# EAGLE design planty1 (EAGLE 9.6.2)
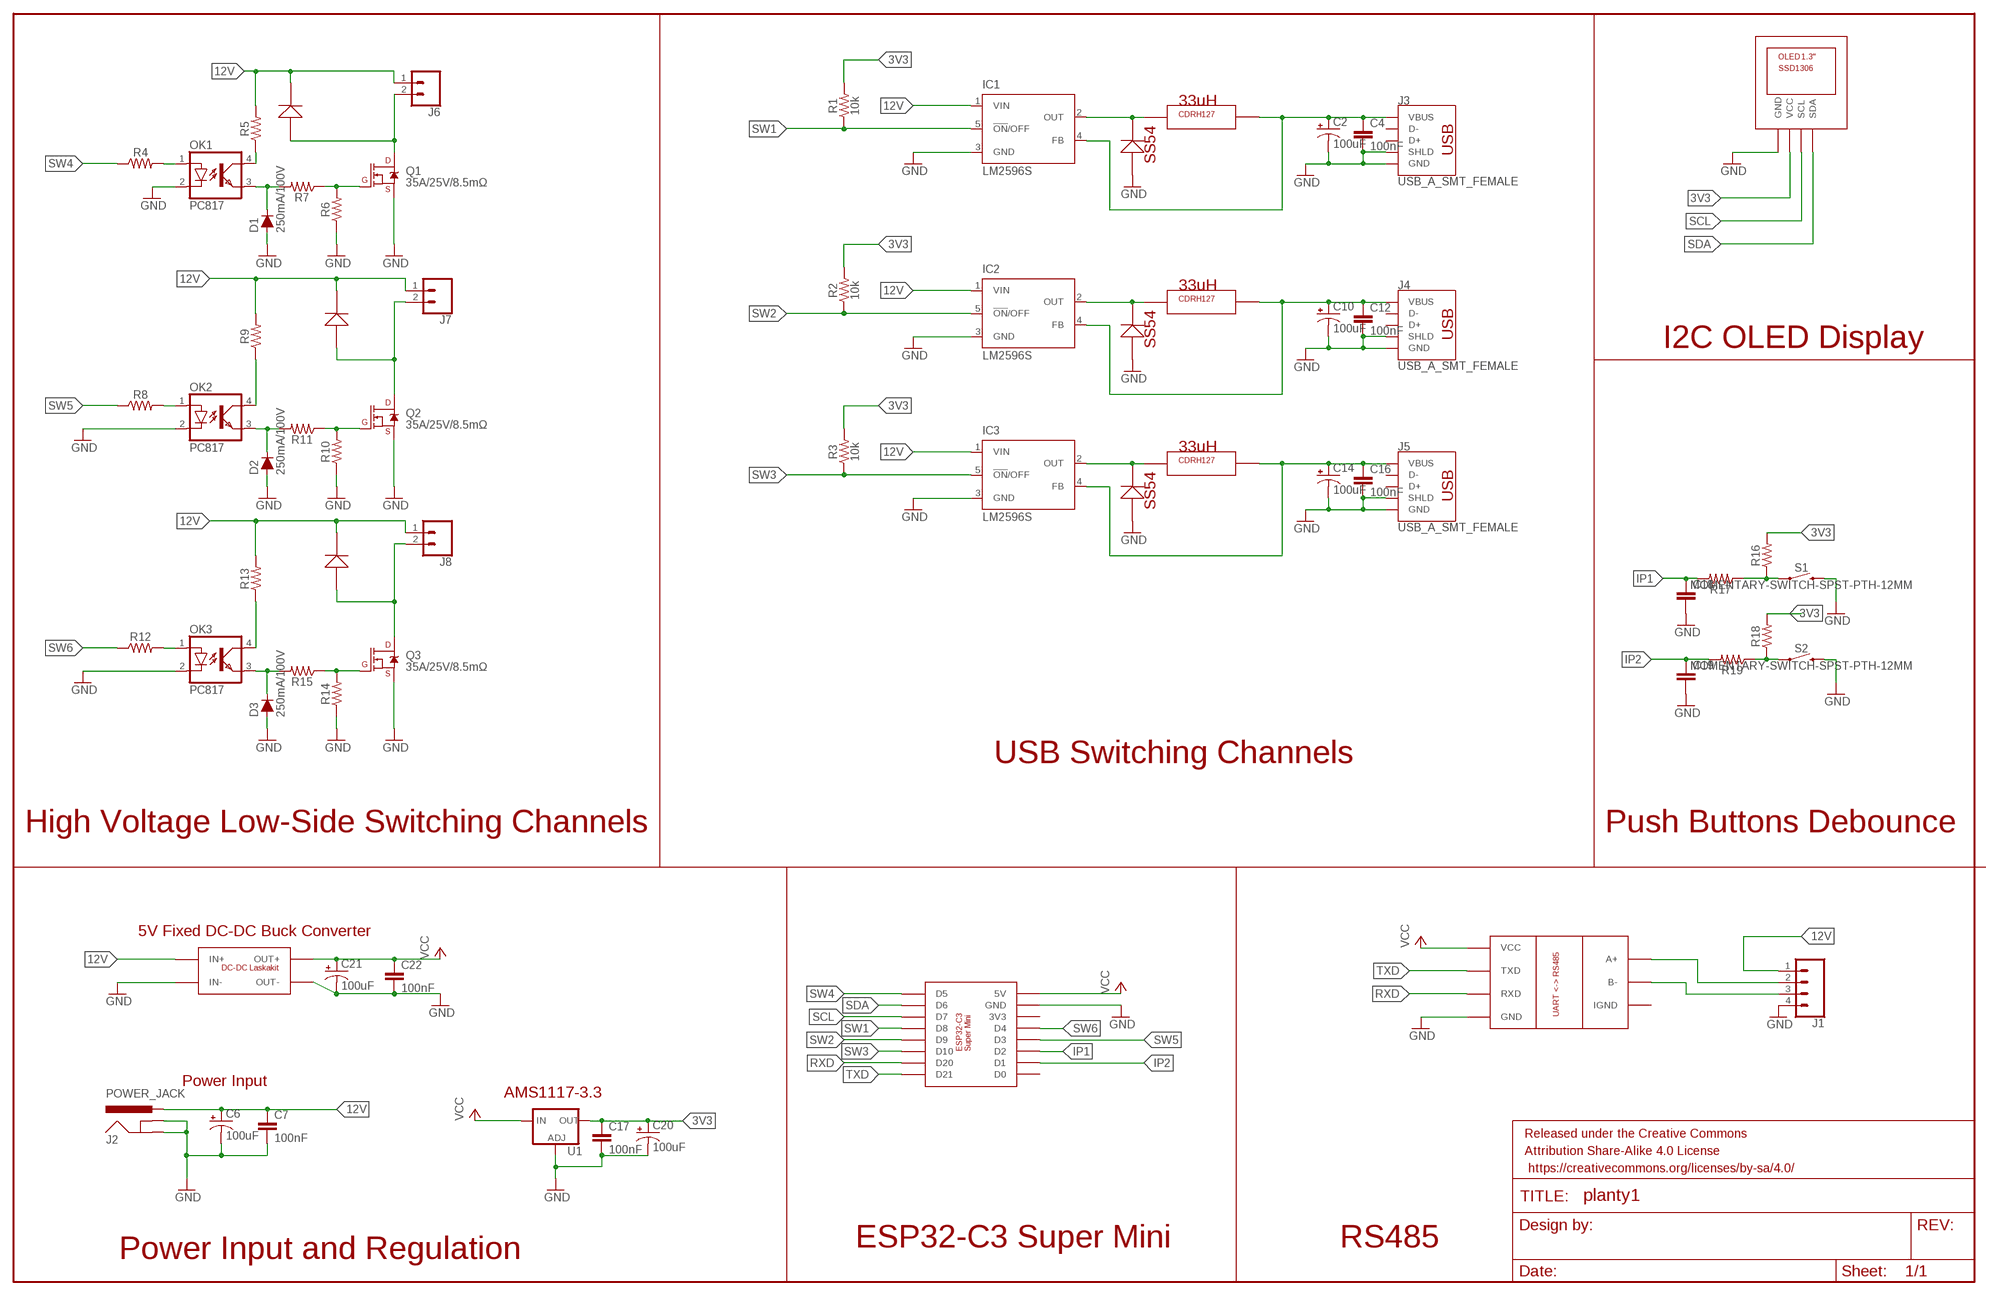
[diagram p0: schematic, sheet 1]

## Parts
C2  100uF  100UF-POLAR-RADIAL-2.5MM-25V-20%  [CPOL-RADIAL-2.5MM-6.5MM]
C4  100nF  CAP-1206  [1206]
C6  100uF  100UF-POLAR-RADIAL-2.5MM-25V-20%  [CPOL-RADIAL-2.5MM-6.5MM]
C7  100nF  CAP-1206  [1206]
C10  100uF  100UF-POLAR-RADIAL-2.5MM-25V-20%  [CPOL-RADIAL-2.5MM-6.5MM]
C12  100nF  CAP-1206  [1206]
C14  100uF  100UF-POLAR-RADIAL-2.5MM-25V-20%  [CPOL-RADIAL-2.5MM-6.5MM]
C16  100nF  CAP-1206  [1206]
C17  100nF  CAP-0603  [0603]
C18  CAP-0603  [0603]
C19  CAP-0603  [0603]
C20  100uF  100UF-POLAR-RADIAL-2.5MM-25V-20%  [CPOL-RADIAL-2.5MM-6.5MM]
C21  100uF  100UF-POLAR-RADIAL-2.5MM-25V-20%  [CPOL-RADIAL-2.5MM-6.5MM]
C22  100nF  CAP-1206  [1206]
D1  250mA/100V  DIODE-BAS16J  [SOD-323]
D2  250mA/100V  DIODE-BAS16J  [SOD-323]
D3  250mA/100V  DIODE-BAS16J  [SOD-323]
FRAME1  FRAME-LEDGERNO_FOOTPRINT  [DUMMY]
IC1  LM2596S  [TO263-5]
IC2  LM2596S  [TO263-5]
IC3  LM2596S  [TO263-5]
J1  CONN_04SCREW_LOCK  [SCREWTERMINAL-3.5MM-4_LOCK]
J2  POWER_JACK  [POWER_JACK_PTH]
J3  USB_A_SMT_FEMALE  [USB-A-S-SILK-FEMALE]
J4  USB_A_SMT_FEMALE  [USB-A-S-SILK-FEMALE]
J5  USB_A_SMT_FEMALE  [USB-A-S-SILK-FEMALE]
J6  CONN_025MM  [SCREWTERMINAL-5MM-2]
J7  CONN_025MM  [SCREWTERMINAL-5MM-2]
J8  CONN_025MM  [SCREWTERMINAL-5MM-2]
OK1  PC817  [DIL04]
OK2  PC817  [DIL04]
OK3  PC817  [DIL04]
Q1  35A/25V/8.5mΩ  MOSFET-NCH-FDD8780  [TO-252/DPAK]
Q2  35A/25V/8.5mΩ  MOSFET-NCH-FDD8780  [TO-252/DPAK]
Q3  35A/25V/8.5mΩ  MOSFET-NCH-FDD8780  [TO-252/DPAK]
R1  10k  RESISTOR0603  [0603]
R2  10k  RESISTOR0603  [0603]
R3  10k  RESISTOR0603  [0603]
R4  RESISTOR0603  [0603]
R5  RESISTOR0603  [0603]
R6  RESISTOR0603  [0603]
R7  RESISTOR0603  [0603]
R8  RESISTOR0603  [0603]
R9  RESISTOR0603  [0603]
R10  RESISTOR0603  [0603]
R11  RESISTOR0603  [0603]
R12  RESISTOR0603  [0603]
R13  RESISTOR0603  [0603]
R14  RESISTOR0603  [0603]
R15  RESISTOR0603  [0603]
R16  RESISTOR0603  [0603]
R17  RESISTOR0603  [0603]
R18  RESISTOR0603  [0603]
R19  RESISTOR0603  [0603]
S1  MOMENTARY-SWITCH-SPST-PTH-12MM  [TACTILE_SWITCH_PTH_12MM]
S2  MOMENTARY-SWITCH-SPST-PTH-12MM  [TACTILE_SWITCH_PTH_12MM]
U1  V_REG_LM1117SOT223  [SOT223]
U$1  ESP32-C3-SUPER-MINI  [ESP32-C3-SUPER-MINI]
U$2  RS485-UART-CONVERTER  [RS485_MODULE]
U$3  CDRH127  [CDRH127]
U$4  SS54  [SS54]
U$5  DC-DC-LASKAKIT  [DC-DC-MODULE-LASKAKIT]
U$6  CDRH127  [CDRH127]
U$7  SS54  [SS54]
U$8  CDRH127 - 33uH  CDRH127  [CDRH127]
U$9  SS54  [SS54]
U$10  SS54  [SS54]
U$11  SS54  [SS54]
U$12  SS54  [SS54]
U$13  OLED_0.96_I2C  [OLED_0.96]

## Nets
3V3: C17.1 C20.1(+) R1.2 R2.2 R3.2 R16.2 R18.2 U1.2(OUT) U1.4(OUT) U$13.P$2(VCC)
12V: C6.1(+) C7.1 IC1.1(VIN) IC2.1(VIN) IC3.1(VIN) J1.1 J2.PWR J6.1 J7.1 J8.1 R5.2 R9.2 R13.2 U$5.IN+ U$10.N U$11.N U$12.N
GND: C2.2(-) C4.2 C6.2(-) C7.2 C10.2(-) C12.2 C14.2(-) C16.2 C17.2 C18.2 C19.2 C20.2(-) C21.2(-) C22.2 D1.A D2.A D3.A IC1.3(GND) IC2.3(GND) IC3.3(GND) J1.4 J2.GND J2.GNDBREAK J3.GND J3.SHLD1(SHLD) J3.SHLD2(SHLD) J4.GND J4.SHLD1(SHLD) J4.SHLD2(SHLD) J5.GND J5.SHLD1(SHLD) J5.SHLD2(SHLD) OK1.2(C) OK2.2(C) OK3.2(C) Q1.3(S) Q2.3(S) Q3.3(S) R6.1 R10.1 R14.1 S1.3 S2.3 U1.1(ADJ) U$1.P$15(GND) U$2.GND U$4.P U$5.IN- U$5.OUT- U$7.P U$9.P U$13.P$1(GND)
IP1: C18.1 R17.2 U$1.P$11(D2)
IP2: C19.1 R19.2 U$1.P$10(D1)
N$1: J1.2 U$2.A+
N$2: J1.3 U$2.B-
N$3: IC1.2(OUT) U$3.P$1 U$4.N
N$4: C2.1(+) C4.1 IC1.4(FB) J3.VBUS U$3.P$2
N$5: IC2.2(OUT) U$6.P$1 U$7.N
N$6: C10.1(+) C12.1 IC2.4(FB) J4.VBUS U$6.P$2
N$7: IC3.2(OUT) U$8.P$1 U$9.N
N$8: C14.1(+) C16.1 IC3.4(FB) J5.VBUS U$8.P$2
N$9: OK1.1(A) R4.2
N$10: OK1.4(COL) R5.1
N$11: Q1.1(G) R6.2 R7.1
N$12: D1.C OK1.3(EMIT) R7.2
N$13: J6.2 Q1.2(D) U$10.P
N$14: OK2.1(A) R8.2
N$15: OK2.4(COL) R9.1
N$16: Q2.1(G) R10.2 R11.1
N$17: D2.C OK2.3(EMIT) R11.2
N$18: J7.2 Q2.2(D) U$11.P
N$19: OK3.1(A) R12.2
N$20: OK3.4(COL) R13.1
N$21: Q3.1(G) R14.2 R15.1
N$22: D3.C OK3.3(EMIT) R15.2
N$23: J8.2 Q3.2(D) U$12.P
N$24: R18.1 R19.1 S2.1
N$25: R16.1 R17.1 S1.1
RXD: U$1.P$7(D20) U$2.RXD
SCL: U$1.P$3(D7) U$13.P$3(SCL)
SDA: U$1.P$2(D6) U$13.P$4(SDA)
SW1: IC1.5(!ON!/OFF) R1.1 U$1.P$4(D8)
SW2: IC2.5(!ON!/OFF) R2.1 U$1.P$5(D9)
SW3: IC3.5(!ON!/OFF) R3.1 U$1.P$6(D10)
SW4: R4.1 U$1.P$1(D5)
SW5: R8.1 U$1.P$12(D3)
SW6: R12.1 U$1.P$13(D4)
TXD: U$1.P$8(D21) U$2.TXD
VCC: C21.1(+) C22.1 U1.3(IN) U$1.P$16(5V) U$2.VCC U$5.OUT+
Unconnected: J3.D+ J3.D- J4.D+ J4.D- J5.D+ J5.D- U$1.P$9(D0) U$1.P$14(3V3) U$2.ISOGND(IGND)

## Notes on the sheet
- 33uH
- SS54
- 33uH
- SS54 | I2C OLED Display
- 33uH
- SS54
- USB Switching Channels
- High Voltage Low-Side Switching Channels | Push Buttons Debounce
- 5V Fixed DC-DC Buck Converter
- Power Input
- AMS1117-3.3
- Power Input and Regulation
- ESP32-C3 Super Mini | RS485

## Library data of the parts
C2 C6 C10 C14 C20 C21 = SparkFun-Capacitors:100UF-POLAR: 100µF polarized capacitors A capacitor is a passive two-terminal electrical component used to store electrical energy temporarily in an electric field.; PROD_ID: CAP-08439
C4 C7 C12 C16-C19 C22 = SparkFun-Capacitors:CAP
D1-D3 = SparkFun-DiscreteSemi:DIODE: Diode These are standard reverse protection diodes and small signal diodes. SparkFun Products: SparkFun SparkPunk Sound Kit <https://www.sparkfun.com/products/11177> SparkFun ESP8266 Thing <https://www.sparkfun.com/products/13231>; PROD_ID: DIO-09646
FRAME1 = SparkFun-Aesthetics:FRAME-LEDGER: Schematic Frame - Ledger Standard 11x14 US Ledger frame
IC1-IC3 = national-semiconductor:LM2596: SIMPLE SWITCHER® Power Converter 150 kHz 3A Step-Down Voltage Regulator Source: http://www.national.com/ds/LM/LM2596.pdf; MF: NATIONAL SEMICONDUCTOR; MPN: LM2596S-ADJ/NOPB; OC_FARNELL: 9494367; OC_NEWARK: 41K3842
J1 = SparkFun-Connectors:CONN_04: Multi connection point. Often used as Generic Header-pin footprint for 0.1 inch spaced/style header connections On any of the 0.1 inch spaced packages, you can populate with these: Break Away Headers - Straight <https://www.sparkfun.com/products/116> (PRT-00116) Break Away Male Headers - Right Angle <https://www.sparkfun.com/products/553> (PRT-00553) Female Headers <https://www.sparkfun.com/products/115> (PRT-00115) Break Away Headers - Machine Pin <https://www.sparkfun.com/products/117> (PRT-00117) Break Away Female Headers - Swiss Machine Pin <https://www.sparkfun.com/products/743> (PRT-00743) For SCREWTERMINALS and SPRING TERMINALS visit here: Screw Terimnals on SparkFun.com <https://www.sparkfun.com/search/results?term=Screw+Terminals> (5mm/3.5mm/2.54mm spacing) This device is also useful as a general connection point to wire up your design to another part of your project. Our various solder wires solder well into these plated through hole pads. Hook-Up Wire - Assortment (Stranded, 22 AWG) <https://www.sparkfun.com/products/11375> (PRT-11375) Hook-Up Wire - Assortment (Solid Core, 22 AWG) <https://www.sparkfun.com/products/11367> (PRT-11367) View the entire wire category on our website here <https://www.sparkfun.com/categories/141> Special notes: Molex polarized connector foot print use with SKU : PRT-08231 with associated crimp pins and housings. 1MM SMD Version SKU: PRT-10208
J2 = SparkFun-Connectors:POWER_JACK: Power Jack Connector This is the standard 5.5mm barrel jack for power. The PTH is the most common, proven, reliable, footprint. The Slot footprint only works if the mill layer is transmitted to the PCB fab house so be warned. Here are the connectors we sell at SparkFun: DC Barrel Power Jack/Connector <https://www.sparkfun.com/products/119> (PRT-00119) DC Barrel Power Jack/Connector (SMD) <https://www.sparkfun.com/products/12748> (PRT-12748) DC Barrel Jack Adapter - Breadboard Compatible <https://www.sparkfun.com/products/10811> (PRT-10811) It is used on this SparkFun product (and many, many others): SparkFun RedBoard - Programmed with Arduino <https://www.sparkfun.com/products/12757> (DEV-12757) Also, if you need a mating power supply or connector, please check these out: Wall Adapter Power Supply - 9VDC 650mA <https://www.sparkfun.com/products/298> (TOL-00298) DC Barrel Jack Adapter - Male <https://www.sparkfun.com/products/10287> (PRT-10287); PROD_ID: CONN-08197
J3-J5 = SparkFun-Connectors:USB_A: USB-A Connector Male and female variants, as well as PTH and SMT variants SparkFun Products: SparkFun XBee Explorer Dongle <https://www.sparkfun.com/products/11697> PTH Male SparkFun MicroView-USB Programmer <https://www.sparkfun.com/products/12924> SMT Male SparkFun USB Type A Female Breakout <https://www.sparkfun.com/products/12700> SMT Female; PROD_ID: CONN-09520; SF_ID: PRT-09011
J6-J8 = SparkFun-Connectors:CONN_02: Multi connection point. Often used as Generic Header-pin footprint for 0.1 inch spaced/style header connections On any of the 0.1 inch spaced packages, you can populate with these: Break Away Headers - Straight <https://www.sparkfun.com/products/116> (PRT-00116) Break Away Male Headers - Right Angle <https://www.sparkfun.com/products/553> (PRT-00553) Female Headers <https://www.sparkfun.com/products/115> (PRT-00115) Break Away Headers - Machine Pin <https://www.sparkfun.com/products/117> (PRT-00117) Break Away Female Headers - Swiss Machine Pin <https://www.sparkfun.com/products/743> (PRT-00743) For SCREWTERMINALS and SPRING TERMINALS visit here: Screw Terimnals on SparkFun.com <https://www.sparkfun.com/search/results?term=Screw+Terminals> (5mm/3.5mm/2.54mm spacing) This device is also useful as a general connection point to wire up your design to another part of your project. Our various solder wires solder well into these plated through hole pads. Hook-Up Wire - Assortment (Stranded, 22 AWG) <https://www.sparkfun.com/products/11375> (PRT-11375) Hook-Up Wire - Assortment (Solid Core, 22 AWG) <https://www.sparkfun.com/products/11367> (PRT-11367) View the entire wire category on our website here <https://www.sparkfun.com/categories/141> Special notes: Molex polarized connector foot print use with: PRT-08233 with associated crimp pins and housings. 2.54_SCREWTERM for use with PRT-10571. 3.5mm Screw Terminal footprints for PRT-08084 5mm Screw Terminal footprints for use with PRT-08432; SF_SKU: PRT-08432
OK1-OK3 = optocoupler:PC817: SHARP OPTO COUPLER; MPN: PC817X4J000F; OC_FARNELL: 9707727; OC_NEWARK: 97K7059
Q1-Q3 = SparkFun-DiscreteSemi:MOSFET-NCH: N-channel MOSFETs Voltage controlled devices that allow control of high current outputs. SparkFun Products: SparkFun OpenScale <https://www.sparkfun.com/products/13261> SparkFun Digital Sandbox <https://www.sparkfun.com/products/12651> SparkFun Monster Moto Shield <https://www.sparkfun.com/products/10182> SparkFun MOSFET Power Controller <https://www.sparkfun.com/products/11214>; PROD_ID: TRANS-09984
R1-R19 = SparkFun-Resistors:RESISTOR: Generic Resistor Package
S1 S2 = SparkFun-Switches:MOMENTARY-SWITCH-SPST: Momentary Switch (Pushbutton) - SPST Normally-open (NO) SPST momentary switches (buttons, pushbuttons). Variants PTH-12MM - 12mm square, through-hole Momentary Pushbutton Switch - 12mm Square <https://www.sparkfun.com/products/9190> (COM-09190) PTH-6.0MM, PTH-6.0MM-KIT - 6.0mm square, through-hole Mini Pushbutton Switch <https://www.sparkfun.com/products/97> (COM-00097) KIT package intended for soldering kit's - only one side of pads' copper is exposed. PTH-RIGHT-ANGLE-KIT - Right-angle, through-hole Right Angle Tactile Button <https://www.sparkfun.com/products/10791> - Used on SparkFun BigTime Watch Kit <https://www.sparkfun.com/products/11734> SMD-12MM - 12mm square, surface-mount Tactile Button - SMD (12mm) <https://www.sparkfun.com/products/12993> (COM-12993) Used on SparkFun PicoBoard <https://www.sparkfun.com/products/11888> SMD-4.5MM - 4.5mm Square Trackball Switch Used on SparkFun Blackberry Trackballer Breakout <https://www.sparkfun.com/products/13169> SMD-4.6MMX2.8MM - 4.60mm x 2.80mm, surface mount Used on SparkFun Pro Micro - RP2040 <https://www.sparkfun.com/products/17717> SMD-5.2MM, SMD-5.2-REDUNDANT - 5.2mm square, surface-mount Mini Pushbutton Switch - SMD <https://www.sparkfun.com/products/8720> (COM-08720) Used on Arduino Pro Mini <https://www.sparkfun.com/products/11114> REDUNDANT package connects both switch circuits together SMD-6.0X3.5MM - 6.0 x 3.5mm, surface mount Momentary Reset Switch SMD <https://www.sparkfun.com/products/8229> (COM-08229) SMD-6.2MM-TALL - 6.2mm square, surface mount Tactile Button - SMD (6mm) <https://www.sparkfun.com/products/12992> Used on SparkFun Digital Sandbox <https://www.sparkfun.com/products/12651> SMD-RIGHT-ANGLE - Right-angle, surface mount Used on SparkFun Block for Intel® Edison - Arduino <https://www.sparkfun.com/products/13036>; PROD_ID: SWCH-09185; SF_SKU: COM-09190
U1 = SparkFun-IC-Power:V_REG_LM1117: Voltage Regulator LM1117 Standard adjustable voltage regulator but in SMD form. Spark Fun Electronics SKU : COM-00595; PROD_ID: VREG-08170
U$1 = Hatch Prototype:ESP32-C3-SUPER-MINI
U$2 = Hatch Prototype:RS485-UART-CONVERTER
U$3 U$6 U$8 = Hatch Prototype:CDRH127
U$4 U$7 U$9-U$12 = Hatch Prototype:SS54
U$5 = Hatch Prototype:DC-DC-LASKAKIT
U$13 = Hatch Prototype:OLED_0.96_I2C

## Board
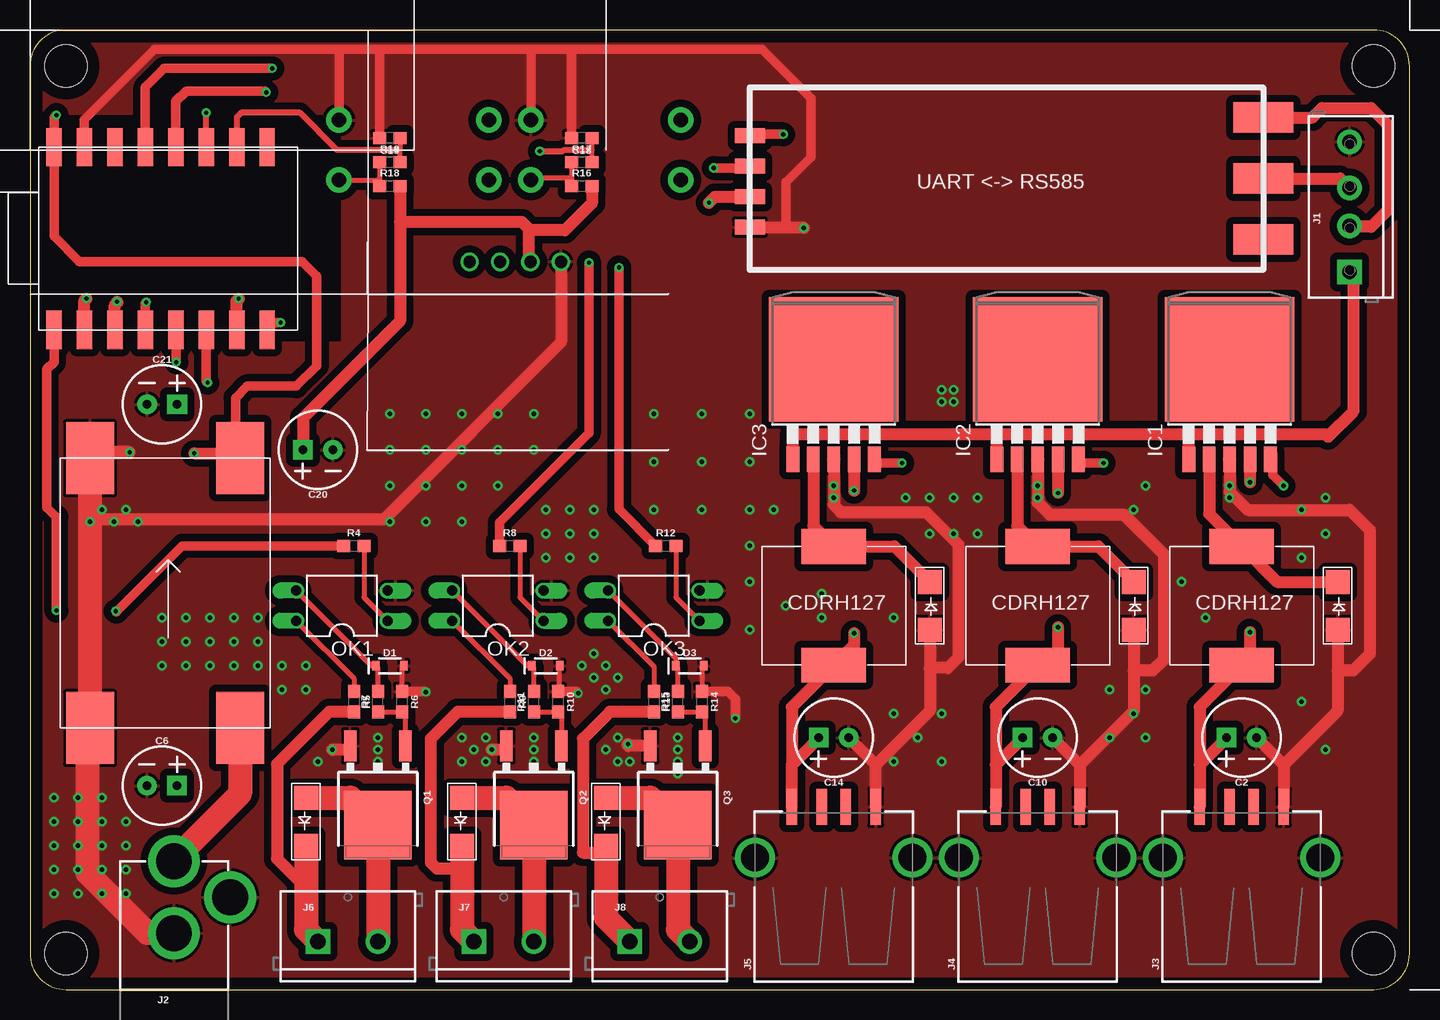
[diagram p1: board, top side]
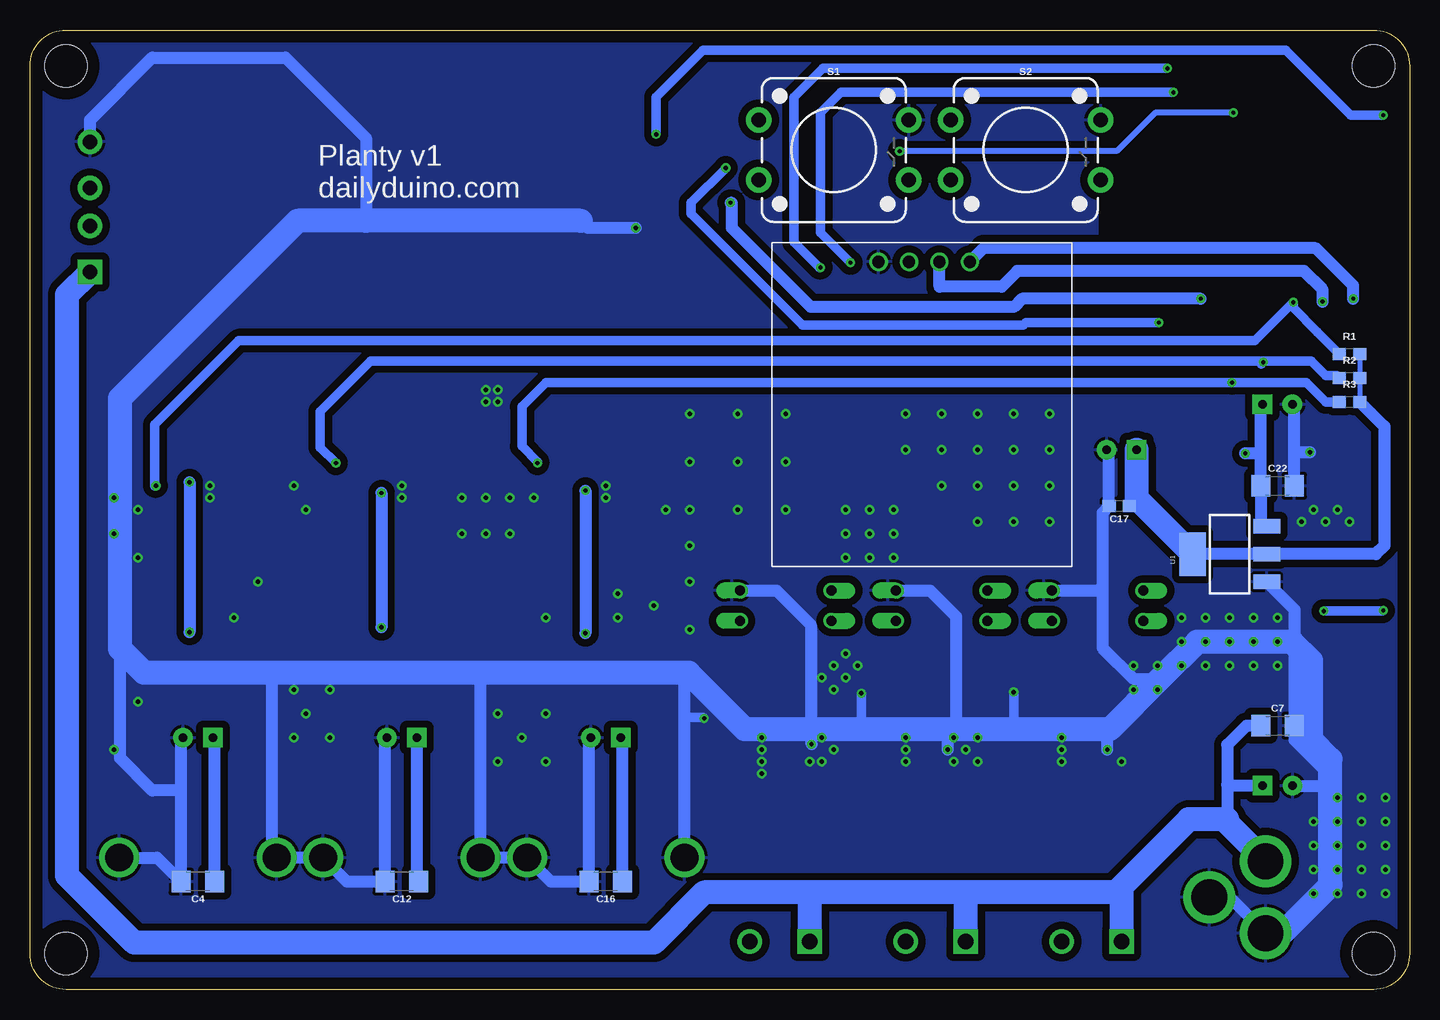
[diagram p2: board, bottom side, seen from below]

Size 115 x 80 mm. Coordinates in mm from the lower left corner, seen from the top.
Outline: 0,77 0,3 arc90 3,0 112,0 arc90 115,3 115,77 arc90 112,80 3,80 arc90 0,77
Copper layers (1*16): Top 0.035mm / dielectric 1.5mm / Bottom 0.035mm
Design rules "default *": minimum track width 6mil, minimum drill 0.35mm, track to track 6mil, track to pad 6mil, pad to pad 6mil, via to via 6mil, smd to smd 6mil, copper to edge 40mil, drill to drill 6mil, minimum pad ring 10mil, minimum via ring 8mil, stop-mask expansion 4mil, vias tented up to drill 24mil, thermal gap 10mil
Holes 3.5 mm at 3,3 112,3 3,77 112,77

### Footprints (pad centres in the part's own frame; a part is rotated, then mirrored left to right if it is on the bottom)
CPOL-RADIAL-2.5MM-6.5MM = drill 0.7 pad 1.651 square: 1 1.25,0 | drill 0.7 pad 1.651: 2 -1.25,0
1206 = smd 1.6 x 1.8: 1 -1.4,0; 2 1.4,0
0603 = smd 1.1 x 1: 1 -0.85,0; 2 0.85,0
SOD-323 = smd 0.63 x 0.83: A 1.15,0; C -1.15,0
TO263-5 = smd 1.067 x 2.159: 1 -3.404,-5.791; 2 -1.702,-5.791; 3 0,-5.791; 4 1.702,-5.791; 5 3.404,-5.791 | smd 10.8 x 10.41: 6 0,2.54
SCREWTERMINAL-3.5MM-4_LOCK = drill 1.2 pad 2.032 square: 1 -0.178,0 | drill 1.2 pad 2.032: 2 3.678,0; 3 6.822,0; 4 10.678,0
POWER_JACK_PTH = drill 2.997 pad 4.318: GND 0,7.7; GNDBREAK 4.7,10.7; PWR 0,13.7
USB-A-S-SILK-FEMALE = smd 3 x 0.9: D+ 7.212,-1; D- 7.212,1; GND 7.212,-3.5; VBUS 7.212,3.5 | drill 2.311: SHLD1 3,-6.566; SHLD2 3,6.566
SCREWTERMINAL-5MM-2 = drill 1.3 pad 2.032 square: 1 0,0 | drill 1.3 pad 2.032: 2 5,0
DIL04 = drill 0.813 offset: 1 -1.27,-3.81; 2 1.27,-3.81; 3 1.27,3.81; 4 -1.27,3.81
TO-252/DPAK = smd 1.06 x 2.6: 1 -2.3,-4.31; 3 2.3,-4.31 | smd 5.632 x 5.7: 2 0,2.288
TACTILE_SWITCH_PTH_12MM = drill 1.2 pad 2.159: 1 6.25,-2.5; 2 -6.25,-2.5; 3 6.25,2.5; 4 -6.25,2.5
SOT223 = smd 1.219 x 2.235: 1 -2.311,-3.099; 2 0,-3.099; 3 2.311,-3.099 | smd 3.6 x 2.2: 4 0,3.099
ESP32-C3-SUPER-MINI = smd 1.27 x 3.175: P$1 0,0; P$2 2.54,0; P$3 5.08,0; P$4 7.62,0; P$5 10.16,0; P$6 12.7,0; P$7 15.24,0; P$8 17.78,0; P$9 17.78,15.24; P$10 15.24,15.24; P$11 12.7,15.24; P$12 10.16,15.24; P$13 7.62,15.24; P$14 5.08,15.24; P$15 2.54,15.24; P$16 0,15.24
RS485_MODULE = smd 5 x 2.55: A+ 42.8,12.7; B- 42.8,7.62; ISOGND 42.8,2.54 | smd 2.5 x 1.27: GND 0,3.56; RXD 0,6.1; TXD 0,8.64; VCC 0,11.18
CDRH127 = smd 5.4 x 2.9: P$1 0,4.95; P$2 0,-4.95
SS54 = smd 2 x 2: N 2,0; P -2,0
DC-DC-MODULE-LASKAKIT = smd 4 x 6: IN+ 15,0; IN- 2.5,0; OUT+ 15,22.5; OUT- 2.5,22.5
OLED_0.96 = drill 1.016: P$1 8.89,25.4; P$2 11.43,25.4; P$3 13.97,25.4; P$4 16.51,25.4

### Placement (x,y rotation side)
C2  101,21 180 top
C4  101,9 180 bottom
C6  11,17 0 top
C7  11,22 0 bottom
C10  84,21 180 top
C12  84,9 180 bottom
C14  67,21 180 top
C16  67,9 180 bottom
C17  24.2,40.3 180 bottom
C18  46,71 180 top
C19  30,71 180 top
C20  24,45 180 top
C21  11.01,48.79 0 top
C22  11,42 0 bottom
D1  30,27 0 top
D2  43,27 0 top
D3  55,27 0 top
FRAME1  -23.1,-4.1 0 top  (outside the outline)
IC1  100,50 0 top
IC2  84,50 0 top
IC3  67,50 0 top
J1  110,60 90 top
J2  12,-3 0 top
J3  101,8 90 top
J4  84,8 90 top
J5  67,8 90 top
J6  24,4 0 top
J7  37,4 0 top
J8  50,4 0 top
OK1  26,32 90 top
OK2  39,32 90 top
OK3  52,32 90 top
Q1  29,16 180 top
Q2  42,16 180 top
Q3  54,16 180 top
R1  5,53 0 bottom
R2  5,51 0 bottom
R3  5,49 0 bottom
R4  27,37 0 top
R5  27,24 270 top
R6  31,24 270 top
R7  29,24 90 top
R8  40,37 0 top
R9  40,24 270 top
R10  44,24 270 top
R11  42,24 90 top
R12  53,37 0 top
R13  52,24 270 top
R14  56,24 270 top
R15  54,24 90 top
R16  46,67 0 top
R17  46,69 0 top
R18  30,67 0 top
R19  30,69 0 top
S1  48,70 0 bottom
S2  32,70 0 bottom
U1  15,36.3 90 bottom
U$1  2,55 0 top
U$2  60,60 0 top
U$3  101,32 0 top
U$4  109,32 90 top
U$5  2.52,21.81 0 top
U$6  84,32 0 top
U$7  92,32 90 top
U$8  67,32 0 top
U$9  75,32 90 top
U$10  23,14 270 top
U$11  36,14 270 top
U$12  48,14 270 top
U$13  53.15,35.27 0 bottom

### Tracks (layer width: path | path; a pad name or v marks a point on that pad's centre or on a via)
3V3
  Top 1: R18.2 30.85,64 | 30.85,64 30.85,55.75 22.75,47.65 C20.1 | U$13.P$2 41.6,60.79 41.6,63.4 | 41.6,63.4 41,64 30.85,64 | R16.2 46.85,65.55 44.6,63.3 41.7,63.3 41.6,63.4
  Bottom 0.4: R1.2 R2.2 R3.2
  Bottom 0.8: C17.1 22.75,40.9 22.75,40.95
  Bottom 1: R3.2 2.1,46.95 2.1,37 2.8,36.3 U1.2 U1.4
  Bottom 2: U1.4 22.75,40.95 C20.1
12V
  Top 1: R9.2 35.65,23.15 33.4,20.9 33.4,10.6 33.9,10.1 36,10.1 | R5.2 24.95,23.15 20.6,18.8 20.6,10.9 22.2,9.3 23,9.3 | R13.2 48.35,23.15 46.1,20.9 46.1,11.4 47.4,11.4 U$12.N | IC3.1 63.6,46.2 63.7,46.3 80.5,46.3 | 80.5,46.3 96.5,46.3 | 96.5,46.3 108,46.3 108.2,46.1 110.35,48.25 110.35,59.47 J1.1 | IC2.1 80.6,46.2 80.5,46.3 | IC1.1 96.6,46.2 96.5,46.3
  Top 2: U$10.N 23,9.3 23,5 J6.1 | U$11.N 36,10.1 36,5 J7.1 | U$12.N 48,6 J8.1 | J2.PWR 12,10.8 17.52,16.32 U$5.IN+
  Bottom 1: C7.1 13.6,22 15.2,20.4 15.2,17.1 | 15.2,17.1 15.2,14.2 | C6.1 15.1,17 15.2,17.1
  Bottom 2: J2.PWR 15.2,13.9 15.2,14.2 18.4,14.2 24.1,8.5 | 24.1,8.5 24.1,8.1 37,8.1 | J1.1 111.9,57.92 111.9,9.5 106.3,3.9 63,3.9 58.8,8.1 50.3,8.1 | 37,8.1 50.3,8.1 | J6.1 24,8.4 24.1,8.5 | J7.1 37,8.1 | J8.1 50,7.8 50.3,8.1
GND  (via drill 0.35)
  Top 0.4: R10.1 44.15,25 D2.A | R6.1 31,26.85 D1.A | R14.1 56,26.85 D3.A
  Top 0.8: U$1.P$15 4.54,72.54 10.4,78.4 25.8,78.4 | 25.8,78.4 29.4,78.4 | 29.4,78.4 41.8,78.4 | 41.8,78.4 45.1,78.4 | 45.1,78.4 61,78.4 65.1,74.3 65.1,69.4 63,67.3 63,63.56 | S2.3 25.75,78.35 25.8,78.4 | S1.3 41.75,78.35 41.8,78.4 | C19.2 29.15,78.15 29.4,78.4 | C18.2 45.15,78.35 45.1,78.4 | R6.1 32.95,24.85 v33,24.8 | R10.1 45.55,24.85 v45.7,24.7 | R14.1 58.2,24.85 58.8,24.25 v58.8,22.6
  Top 1: v8.3,44.8 5.2,44.8 4.9,45.1 | J5.GND 70.5,18.75 | 70.5,18.75 C14.2 | U$9.P 75,26.8 | 75,26.8 75,23.25 70.5,18.75 | C10.2 87.5,18.75 | 87.5,18.75 J4.GND | U$7.P 92,26.6 | 92,26.6 92,23.25 87.5,18.75 | C2.2 104.5,18.75 | 104.5,18.75 J3.GND | IC3.3 67,40.4 67.6,39.8 74.7,39.8 77.4,37.1 77.4,27.7 76.5,26.8 75,26.8 | IC2.3 84,40.6 85,39.6 91.2,39.6 94.5,36.3 94.5,27.5 93.6,26.6 92,26.6 | U$4.P 109,26.6 | 109,26.6 109,23.25 104.5,18.75 | IC1.3 100,41.5 101.5,40 110,40 111.7,38.3 111.7,28 110.3,26.6 109,26.6 | U$2.GND 63,63.56 64.44,63.56 v64.5,63.5 | Q3.3 49.89,20.31 49.8,20.4 v49.85,20.45 | Q2.3 39.39,20 v38.5,20 | Q1.3 26.39,20 v25.2,20 | U$13.P$1 44.26,53.96 29.5,39.2 5.02,39.2
  Top 2: J2.GND 9.8,4.7 4.8,9.7 4.8,22.3 4.9,22.4 4.9,22.8 4.7,23 4.7,22.13 U$5.IN- 5.02,39.2 U$5.OUT- | U$5.OUT- 5.02,44.98 4.9,45.1 4.9,44.43 U$5.OUT-
  Bottom 0.8: v33,24.8 33,21.8 33.1,21.7 | v45.7,24.7 45.7,21.8 45.6,21.7 | v58.8,22.6 58.9,22.7 60.43,22.7
  Bottom 1: 6.6,17 6.6,17.8 9.6,20.8 C7.2 9.6,31.69 U1.1 | 6.6,8.7 6.6,8.8 6.6,17 | J2.GND 15,7.7 J2.GNDBREAK | C6.2 6.6,17 | C22.2 9.6,44.9 | 9.6,44.9 9.6,48.63 C21.2 | C20.2 25.05,44.8 C17.2 25.6,39.75 25.6,33.6 | 9.6,44.9 9.5,44.8 v8.3,44.8 | C14.2 68.4,20.85 C16.2 71.57,9 J5.SHLD1 J4.SHLD2 77.43,26.23 77.6,26.4 | C10.2 85.4,20.85 C12.2 88.57,9 J4.SHLD1 J3.SHLD2 94.8,11.37 94.8,26.4 | v64.5,63.5 68.5,63.5 69.1,64.1 | J1.4 110,72.5 104.8,77.7 93.7,77.7 87,71 87,64.1 | J5.SHLD2 60.43,22.7 60.43,26.07 60.1,26.4 | J3.SHLD1 104.4,11 C4.2 102.4,16.6 | 102.4,16.6 102.4,20.85 C2.2 | v49.85,20.45 49.85,21.65 49.9,21.7 49.9,30.4 52.77,33.27 OK3.2 | v38.5,20 38.5,21.6 38.6,21.7 37.8,22.5 37.8,31.1 39.97,33.27 OK2.2 | v25.2,20 25.2,21.5 25,21.7 | 25.6,33.6 25.6,28.5 23,25.9 20.8,25.9 | OK1.2 25.93,33.27 25.6,33.6 | 102.4,16.6 104.8,16.6 107.5,19.3 107.5,29.5
  Bottom 2: J2.GND 10.6,4.7 6.6,8.7 | 6.6,8.8 6.6,19.2 8.2,20.8 8.2,27.4 9.8,29 17.7,29 20.8,25.9 25,21.7 33.1,21.7 38.6,21.7 45.6,21.7 49.9,21.7 55.4,21.7 60.1,26.4 77.6,26.4 94.8,26.4 105.5,26.4 107.5,28.4 107.5,29.5 107.5,49.3 92.7,64.1 87,64.1 69.1,64.1
  other vias: 2,16 4,16 6,16 6,14 4,14 2,14 2,12 4,12 6,12 2,10 4,10 6,10 2,8 4,8 6,8 8,8 8,10 8,12 8,14 11,31 11,29 11,27 13,27 13,29 13,31 15,31 15,29 15,27 17,27 17,29 17,31 19,31 19,29 19,27 21,27 23,27 21,25 23,25 24,19 29,21 29,20 29,19 36,19 36,21 38,21 38,19 37,20 42,21 42,20 42,19 48,20 49,19 50,19 49,21 54,21 54,20 54,19 54,18 46,27 48,27 48,25 47,26 47,28 49,26 5,39 7,39 9,39 8,40 6,40 30,48 33,48 36,48 39,48 42,48 30,45 33,45 36,45 39,45 42,45 30,42 33,42 36,42 39,42 30,39 33,39 36,39 43,40 45,40 47,40 45,38 47,38 43,38 45,36 47,36 43,36 52,48 56,48 60,48 52,44 56,44 60,44 60,40 56,40 52,40 60,37 60,34 60,30 63,32 66,33 66,31 62,40 77,49 76,50 76,49 77,50 73,41 75,41 77,41 79,41 75,38 77,38 79,38 67,42 67,41 84,42 84,41 100,42 100,41 108,41 108,38 106,40 106,36 90,25 93,25 93,21 90,21 72,23 76,23 76,19 72,19 74,21 92,23 72,31 106,24 108,20 98,31 96,34 92,40 93,42
  pour Top (isolate 0.61): 0,0 0,54 26,54 26,73 0,73 0,80 115,80 115,0
  pour Bottom (isolate 0.61): 0,0 0,54 26,54 26,73 0,73 0,80 115,80 115,0
IP1  (via drill 0.35)
  Top 0.4: R17.2 46.85,70 C18.1
  Top 0.5: U$1.P$11 v14.7,73.1 | v42.5,69.9 44.43,69.9 44.53,70 46.85,70
  Bottom 0.5: v14.7,73.1 21.2,73.1 24.4,69.9 v42.5,69.9
IP2
  Top 0.4: R19.2 30.85,70 C19.1
  Top 0.5: 30.85,70 25.6,70 22.5,73.1 17.6,73.1 17.24,72.74 U$1.P$10
N$1
  Top 1: U$2.A+ 106.9,72.7 107.7,73.5 111.8,73.5 113.2,72.1 113.2,65 111.8,63.6 110.08,63.6 J1.2
N$2
  Top 1: U$2.B- 109.2,67.62 J1.3
N$3
  Top 1: IC1.2 98.3,39.65 U$3.P$1 103.95,34 U$4.N
N$4  (via drill 0.35)
  Top 1: C2.1 97.5,18.75 | 97.5,18.75 J3.VBUS | U$3.P$2 100.67,26.73 | 100.67,26.73 97.5,23.55 97.5,18.75 | IC1.4 v101.7,42.3 | v101.7,29.8 101.7,27 101.42,26.73 100.67,26.73
  Bottom 1: v101.7,42.3 v101.7,29.8 | C4.1 99.6,20.85 C2.1
N$5
  Top 1: U$7.N 89.05,36.95 U$6.P$1 82.3,38.65 IC2.2
N$6  (via drill 0.35)
  Top 1: C10.1 80.5,18.75 | 80.5,18.75 J4.VBUS | U$6.P$2 83.83,26.88 | 83.83,26.88 80.5,23.55 80.5,18.75 | IC2.4 v85.7,41.4 | v85.7,30.2 85.7,27.6 84.8,26.7 84,26.7 83.83,26.88
  Bottom 1: v85.7,41.4 v85.7,30.2 | C12.1 82.75,9.15 C10.1
N$7
  Top 1: IC3.2 65.3,38.65 U$8.P$1 72.05,36.95 U$9.N
N$8  (via drill 0.35)
  Top 1: J5.VBUS 63.5,18.75 | 63.5,18.75 C14.1 | 63.5,18.75 63.5,23.55 U$8.P$2 68.7,28.75 v68.7,29.7 | IC3.4 v68.7,41.6
  Bottom 1: C16.1 65.6,20.85 C14.1 | v68.7,41.6 v68.7,29.7
N$9
  Top 0.4: R4.2 27.85,32.69 OK1.1
N$10
  Top 0.4: OK1.4 27,25.92 R5.1
N$11
  Top 0.4: R7.1 R6.2 31.3,22.85 Q1.1
N$12
  Top 0.4: R7.2 29,26.85 D1.C 28.46,27 OK1.3
N$13
  Top 2: U$10.P 26.71,16 Q1.2 J6.2
N$14
  Top 0.4: R8.2 40.85,32.69 OK2.1
N$15
  Top 0.4: OK2.4 40,25.92 R9.1
N$16
  Top 0.4: Q2.1 44.3,22.85 R10.2 R11.1
N$17
  Top 0.4: R11.2 42,26.85 D2.C 41.46,27 OK2.3
N$18
  Top 2: U$11.P 39.71,16 Q2.2 J7.2
N$19
  Top 0.4: R12.2 53.85,32.69 OK3.1
N$20
  Top 0.4: OK3.4 52,26.92 R13.1
N$21
  Top 0.4: R15.1 R14.2 56.3,22.85 Q3.1
N$22
  Top 0.4: R15.2 54,26.85 D3.C 53.85,27.61 OK3.3
N$23
  Top 2: U$12.P 51.71,16 Q3.2 54,5 J8.2
N$24
  Top 0.4: R19.1 29.15,67.3 | 29.15,67.3 R18.1 | S2.1 28.95,67.5 29.15,67.3
N$25
  Top 0.4: R17.1 45.15,67.7 | 45.15,67.7 R16.1 | S1.1 41.95,67.7 45.15,67.7
RXD  (via drill 0.35)
  Top 1: U$1.P$7 17.24,57.36 17.2,57.4 v17.4,57.6 | v56.6,65.6 57.1,66.1 U$2.RXD
  Bottom 1: v17.4,57.6 32.3,57.6 33,56.9 49.9,56.9 56.5,63.5 56.5,65.6 v56.6,65.6
SCL  (via drill 0.35)
  Top 1: U$1.P$3 7.08,57.08 7.3,57.3 v7.25,57.35
  Bottom 1: v7.25,57.35 7.25,58.35 8.8,59.9 32.7,59.9 34,58.6 39.18,58.6 U$13.P$3
SDA  (via drill 0.35)
  Top 1: U$1.P$2 4.54,57.44 v4.7,57.6
  Bottom 1: v4.7,57.6 4.7,58.7 7.8,61.8 35.51,61.8 U$13.P$4
SW1  (via drill 0.35)
  Top 0.8: v9.7,57.3 9.62,57.22 U$1.P$4 | v104.5,42 103.6,42.9 103.6,44.7 103.4,44.5 IC1.5
  Bottom 0.8: R1.1 7.67,54.83 9.7,56.85 v9.7,57.3 12.9,54.1 97.6,54.1 104.6,47.1 104.6,42 v104.5,42
SW2  (via drill 0.35)
  Top 0.8: v12.2,52.3 12.2,54.96 U$1.P$5 | v89.5,43.9 87.71,43.9 IC2.5
  Bottom 0.8: R2.1 6.05,51.2 7,51.2 8.2,52.4 12.6,52.4 | v12.2,52.3 12.35,52.15 12.6,52.4 | v89.5,43.9 90.8,45.2 90.8,48.2 86.6,52.4 12.6,52.4
SW3  (via drill 0.35)
  Top 0.8: v14.8,50.6 14.7,50.7 U$1.P$6 | v72.7,43.9 70.71,43.9 IC3.5
  Bottom 0.8: R3.1 7,49 8.6,50.6 v14.8,50.6 72,50.6 74,48.6 74,45.3 72.7,44 v72.7,43.9
SW4  (via drill 0.35)
  Top 0.8: R4.1 12.7,37 7.2,31.5 v7.15,31.55 | v2.2,31.6 2.2,39.4 1.42,40.18 1.42,51.72 2,52.3 U$1.P$1
  Bottom 0.8: v7.15,31.55 2.25,31.55 v2.2,31.6
SW5  (via drill 0.35)
  Top 0.8: U$1.P$12 12.16,74.06 13,74.9 19.6,74.9 v19.7,74.8 | v46.6,60.6 46.6,46.4 39.15,38.95 R8.1
  Bottom 0.8: v19.7,74.8 47.4,74.8 49.1,73.1 49.1,63.1 v46.6,60.6
SW6  (via drill 0.35)
  Top 0.8: U$1.P$13 9.62,75.22 11.2,76.8 v20.2,76.8 | v49.1,60.2 49.1,40.05 R12.1
  Bottom 0.8: v20.2,76.8 48.9,76.8 51.3,74.4 51.3,62.3 49.2,60.2 v49.1,60.2
TXD  (via drill 0.35)
  Top 0.8: U$1.P$8 20.38,55.6 v20.9,55.6 | v57,68.5 59.86,68.5 U$2.TXD
  Bottom 0.8: v20.9,55.6 32,55.6 32.2,55.4 50.6,55.4 59.9,64.7 59.9,65.6 v57,68.5
VCC  (via drill 0.35)
  Top 0.8: 17.13,44.7 17.13,49.33 18.1,50.3 22.2,50.3 23.9,52 23.9,59.5 22.7,60.7 4.1,60.7 2,62.8 U$1.P$16 2,72.7 v2.2,72.9 | v62.8,71.3 60.12,71.3 U$2.VCC
  Top 1: v13.7,44.7 17.13,44.7 U$5.OUT+
  Bottom 0.8: v2.2,72.9 4.9,72.9 10.3,78.3 58.9,78.3 62.8,74.4 v62.8,71.3
  Bottom 1: 12.4,44.7 C22.1 12.4,39.11 U1.3 | 12.4,44.7 12.4,48.65 C21.1 | 12.4,44.7 v13.7,44.7

### Text on the board
bPlace: Planty v1 / dailyduino.com